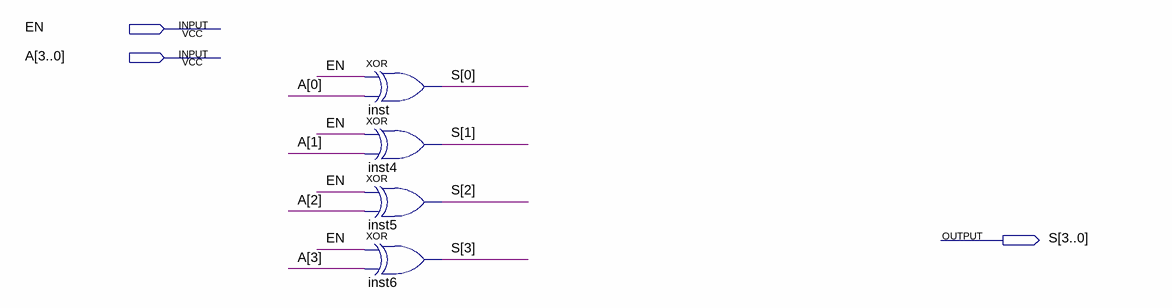
[diagram p0: schematic sheet]
// Quartus schematic C2.bdf as structural Verilog: 4 symbols, 3 pins
module C2 (
  input  EN,
  input  [3:0] A,
  output [3:0] S
);

  xor inst (S[0], EN, A[0]);
  xor inst4 (S[1], EN, A[1]);
  xor inst5 (S[2], EN, A[2]);
  xor inst6 (S[3], EN, A[3]);
endmodule
